# EAGLE design M707A (EAGLE 6.6.0)
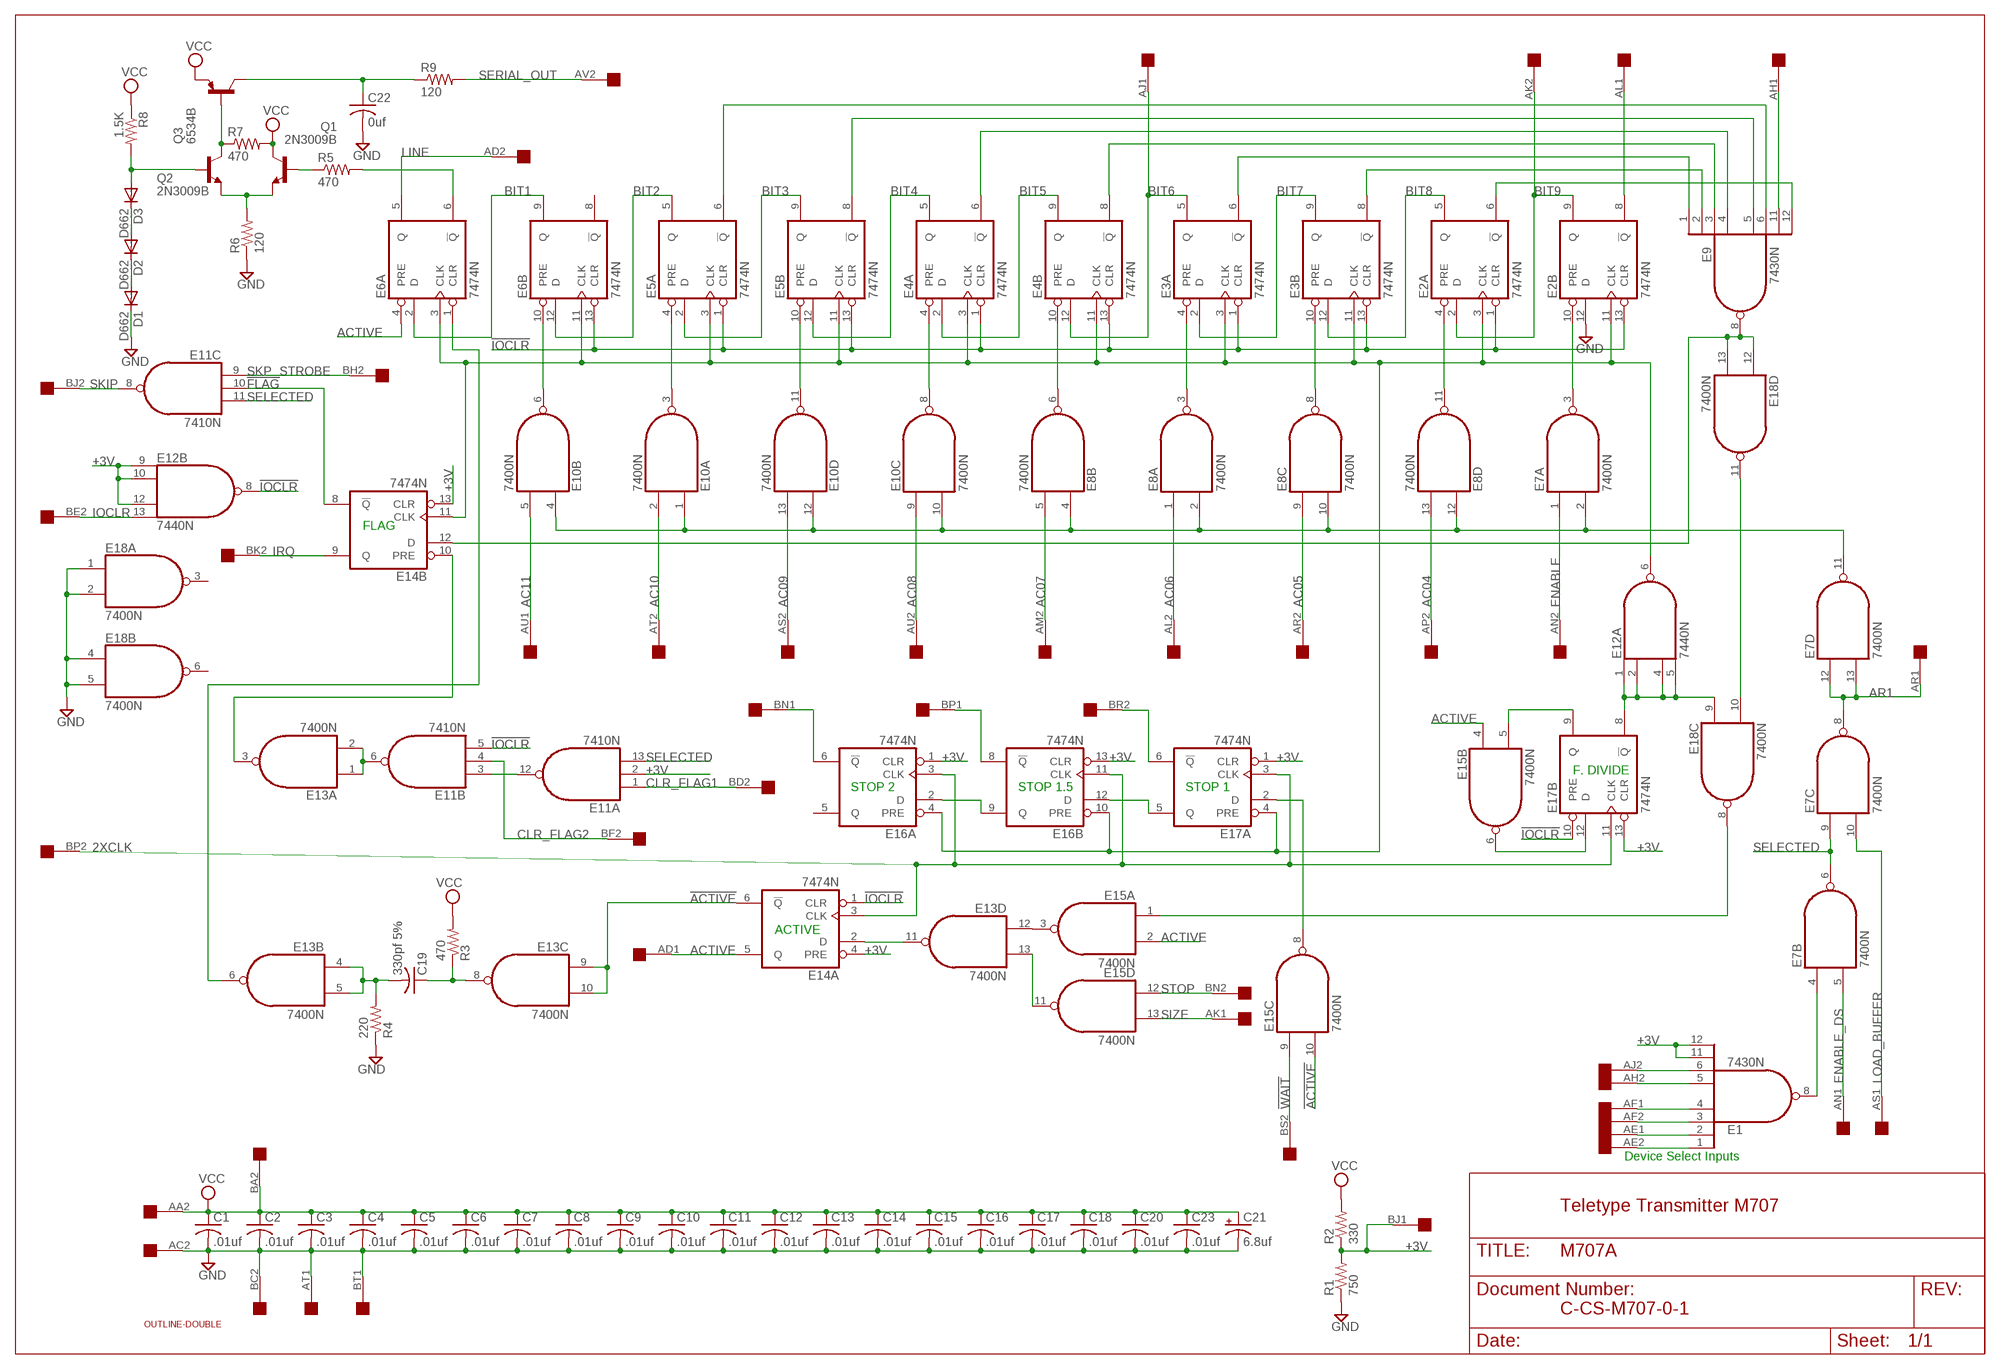
[diagram p0: schematic, sheet 1]

## Parts
C1  .01uf  C-US075-032X103  [C075-032X103]
C2  .01uf  C-US075-032X103  [C075-032X103]
C3  .01uf  C-US075-032X103  [C075-032X103]
C4  .01uf  C-US075-032X103  [C075-032X103]
C5  .01uf  C-US075-032X103  [C075-032X103]
C6  .01uf  C-US075-032X103  [C075-032X103]
C7  .01uf  C-US075-032X103  [C075-032X103]
C8  .01uf  C-US075-032X103  [C075-032X103]
C9  .01uf  C-US075-032X103  [C075-032X103]
C10  .01uf  C-US075-032X103  [C075-032X103]
C11  .01uf  C-US075-032X103  [C075-032X103]
C12  .01uf  C-US075-032X103  [C075-032X103]
C13  .01uf  C-US075-032X103  [C075-032X103]
C14  .01uf  C-US075-032X103  [C075-032X103]
C15  .01uf  C-US075-032X103  [C075-032X103]
C16  .01uf  C-US075-032X103  [C075-032X103]
C17  .01uf  C-US075-032X103  [C075-032X103]
C18  .01uf  C-US075-032X103  [C075-032X103]
C19  330pf 5%  C-US150-054X183  [C150-054X183]
C20  .01uf  C-US075-032X103  [C075-032X103]
C21  6.8uf  CPOL-USE15-5AXIAL  [E15-5]
C22  0uf  C-US075-032X103  [C075-032X103]
C23  .01uf  C-US075-032X103  [C075-032X103]
D1  D662  BY609  [SOD61B]
D2  D662  BY609  [SOD61B]
D3  D662  BY609  [SOD61B]
E1  7430N  [DIL14]
E2  7474N  74S74N  [DIL14]
E3  7474N  74S74N  [DIL14]
E4  7474N  74S74N  [DIL14]
E5  7474N  74S74N  [DIL14]
E6  7474N  74S74N  [DIL14]
E7  7400N  [DIL14]
E8  7400N  [DIL14]
E9  7430N  [DIL14]
E10  7400N  [DIL14]
E11  7410N  [DIL14]
E12  7440N  74S20N  [DIL14]
E13  7400N  [DIL14]
E14  7474N  74S74N  [DIL14]
E15  7400N  [DIL14]
E16  7474N  74S74N  [DIL14]
E17  7474N  74S74N  [DIL14]
E18  7400N  [DIL14]
Q1  2N3009B  2N4124-NPN-TO92-CBE  [TO92-CBE]
Q2  2N3009B  2N4124-NPN-TO92-CBE  [TO92-CBE]
Q3  6534B  2N4126-PNP-TO92-CBE  [TO92-CBE]
R1  750  R-US_0207/15  [0207/15]
R2  330  R-US_0207/15  [0207/15]
R3  470  R-US_0207/10  [0207/10]
R4  220  R-US_0207/10  [0207/10]
R5  470  R-US_0207/10  [0207/10]
R6  120  R-US_0207/15  [0207/15]
R7  470  R-US_0207/10  [0207/10]
R8  1.5K  R-US_0207/15  [0207/15]
R9  120  R-US_0207/10  [0207/10]
U$1  OUTLINE-DOUBLE  [DOUBLE]
U$2  DOUBLE  [EDGE-CON4]

## Nets
2XCLK: E14.3(A:CLK) E16.3(A:CLK) E16.11(B:CLK) E17.3(A:CLK) E17.11(B:CLK) U$2.BP2
!ACTIVE: E13.9(C:I0) E13.10(C:I1) E14.6(A:!Q) E15.10(C:I1)
!FLAG: E11.10(C:I1) E14.8(B:!Q)
!IOCLR: E2.1(A:CLR) E2.13(B:CLR) E3.1(A:CLR) E3.13(B:CLR) E4.1(A:CLR) E4.13(B:CLR) E5.1(A:CLR) E5.13(B:CLR) E6.13(B:CLR) E11.5(B:I2) E12.8(B:O) E14.1(A:CLR) E17.10(B:PRE)
!WAIT: E15.9(C:I0) U$2.BS2
+3V: E1.11(I6) E1.12(I7) E11.2(A:I1) E12.9(B:I0) E12.10(B:I1) E12.12(B:I2) E14.4(A:PRE) E14.13(B:CLR) E16.1(A:CLR) E16.13(B:CLR) E17.1(A:CLR) E17.13(B:CLR) R1.2 R2.1 U$2.BJ1
AC04: E8.13(D:I1) U$2.AP2
AC05: E8.9(C:I0) U$2.AR2
AC06: E8.1(A:I0) U$2.AL2
AC07: E8.5(B:I1) U$2.AM2
AC08: E10.9(C:I0) U$2.AU2
AC09: E10.13(D:I1) U$2.AS2
AC10: E10.2(A:I1) U$2.AT2
AC11: E10.5(B:I1) U$2.AU1
ACTIVE: E6.4(A:PRE) E14.5(A:Q) E15.2(A:I1) E15.4(B:I0) U$2.AD1
AE1: E1.2(I1) U$2.AE1
AF1: E1.4(I3) U$2.AF1
AH1: E9.11(I6) U$2.AH1
AL1: E2.8(B:!Q) U$2.AL1
AR1: E7.8(C:O) E7.12(D:I0) E7.13(D:I1) U$2.AR1
BIT1: E6.2(A:D) E6.9(B:Q)
BIT2: E5.5(A:Q) E6.12(B:D)
BIT3: E5.2(A:D) E5.9(B:Q)
BIT4: E4.5(A:Q) E5.12(B:D)
BIT5: E4.2(A:D) E4.9(B:Q)
BIT6: E3.5(A:Q) E4.12(B:D) U$2.AJ1
BIT7: E3.2(A:D) E3.9(B:Q)
BIT8: E2.5(A:Q) E3.12(B:D)
BIT9: E2.2(A:D) E2.9(B:Q) U$2.AK2
BN1: E16.6(A:!Q) U$2.BN1
BP1: E16.8(B:!Q) U$2.BP1
CLR_FLAG1: E11.1(A:I0) U$2.BD2
CLR_FLAG2: E11.4(B:I1) U$2.BF2
ENABLE: E7.1(A:I0) U$2.AN2
ENABLE_DS: E7.5(B:I1) U$2.AN1
GND [Supply]: C1.2 C2.2 C3.2 C4.2 C5.2 C6.2 C7.2 C8.2 C9.2 C10.2 C11.2 C12.2 C13.2 C14.2 C15.2 C16.2 C17.2 C18.2 C20.2 C21.- C22.2 C23.2 D1.C E2.12(B:D) E18.1(A:I0) E18.2(A:I1) E18.4(B:I0) E18.5(B:I1) R1.1 R4.1 R6.1 U$2.AC2 U$2.AT1 U$2.BC2 U$2.BT1
IOCLR: E12.13(B:I3) U$2.BE2
IRQ: E14.9(B:Q) U$2.BK2
LINE: E6.5(A:Q) U$2.AD2
LOAD_BUFFER: E7.10(C:I1) U$2.AS1
N$1: C19.1 E13.8(C:O) R3.1
N$2: C19.2 E13.4(B:I0) E13.5(B:I1) R4.2
N$3: E2.4(A:PRE) E8.11(D:O)
N$4: E6.1(A:CLR) E13.6(B:O)
N$5: E2.3(A:CLK) E2.11(B:CLK) E3.3(A:CLK) E3.11(B:CLK) E4.3(A:CLK) E4.11(B:CLK) E5.3(A:CLK) E5.11(B:CLK) E6.3(A:CLK) E6.11(B:CLK) E12.6(A:O) E14.11(B:CLK) E16.4(A:PRE) E16.10(B:PRE) E17.4(A:PRE)
N$6: E9.8(O) E14.12(B:D) E18.12(D:I0) E18.13(D:I1)
N$7: E2.6(A:!Q) E9.12(I7)
N$8: C22.1 Q3.C R9.1
N$9: E1.8(O) E7.4(B:I0)
N$12: E1.6(I5) U$2.AJ2
N$13: E1.5(I4) U$2.AH2
N$15: E1.3(I2) U$2.AF2
N$17: E1.1(I0) U$2.AE2
N$19: E7.2(A:I1) E7.11(D:O) E8.2(A:I1) E8.4(B:I0) E8.10(C:I1) E8.12(D:I0) E10.1(A:I0) E10.4(B:I0) E10.10(C:I1) E10.12(D:I0)
N$20: E2.10(B:PRE) E7.3(A:O)
N$22: D1.A D2.C
N$23: D2.A D3.C
N$24: Q1.B R5.1
N$26: Q2.C Q3.B R7.1
N$27: Q1.E Q2.E R6.2
N$30: D3.A Q2.B R8.2
N$40: E6.6(A:!Q) R5.2
N$62: E13.13(D:I1) E15.11(D:O)
N$63: E17.6(A:!Q) U$2.BR2
N$65: E3.4(A:PRE) E8.3(A:O)
N$129: E15.1(A:I0) E18.8(C:O)
N$131: E13.12(D:I0) E15.3(A:O)
N$132: E11.3(B:I0) E11.12(A:O)
N$133: E12.1(A:I0) E12.2(A:I1) E12.4(A:I2) E12.5(A:I3) E17.8(B:!Q) E18.9(C:I0)
N$138: E16.2(A:D) E16.9(B:Q)
N$142: E3.6(A:!Q) E9.1(I0)
N$147: E4.4(A:PRE) E10.8(C:O)
N$152: E3.8(B:!Q) E9.2(I1)
N$153: E4.8(B:!Q) E9.3(I2)
N$154: E4.6(A:!Q) E9.4(I3)
N$155: E5.8(B:!Q) E9.5(I4)
N$156: E5.6(A:!Q) E9.6(I5)
N$161: E15.8(C:O) E17.2(A:D)
N$163: E11.6(B:O) E13.1(A:I0) E13.2(A:I1)
N$166: E16.12(B:D) E17.5(A:Q)
N$167: E13.3(A:O) E14.10(B:PRE)
N$171: E5.4(A:PRE) E10.3(A:O)
N$178: E13.11(D:O) E14.2(A:D)
N$358: E15.6(B:O) E17.12(B:D)
N$362: E15.5(B:I1) E17.9(B:Q)
N$378: E3.10(B:PRE) E8.8(C:O)
N$381: E4.10(B:PRE) E8.6(B:O)
N$387: E5.10(B:PRE) E10.11(D:O)
N$393: E6.10(B:PRE) E10.6(B:O)
N$460: E18.10(C:I1) E18.11(D:O)
SELECTED: E7.6(B:O) E7.9(C:I0) E11.11(C:I2) E11.13(A:I2)
SERIAL_OUT: R9.2 U$2.AV2
SIZE: E15.13(D:I1) U$2.AK1
SKIP: E11.8(C:O) U$2.BJ2
SKP_STROBE: E11.9(C:I0) U$2.BH2
STOP: E15.12(D:I0) U$2.BN2
VCC [Supply]: C1.1 C2.1 C3.1 C4.1 C5.1 C6.1 C7.1 C8.1 C9.1 C10.1 C11.1 C12.1 C13.1 C14.1 C15.1 C16.1 C17.1 C18.1 C20.1 C21.+ C23.1 Q1.C Q3.E R2.2 R3.2 R7.2 R8.1 U$2.AA2 U$2.BA2
Unconnected: E6.8(B:!Q) E16.5(A:Q) E18.3(A:O) E18.6(B:O) U$2.AA1 U$2.AB1 U$2.AB2 U$2.AC1 U$2.AM1 U$2.AP1 U$2.AV1 U$2.BA1 U$2.BB1 U$2.BB2 U$2.BC1 U$2.BD1 U$2.BE1 U$2.BF1 U$2.BH1 U$2.BK1 U$2.BL1 U$2.BL2 U$2.BM1 U$2.BM2 U$2.BR1 U$2.BS1 U$2.BT2 U$2.BU1 U$2.BU2 U$2.BV1 U$2.BV2

## Notes on the sheet
- FLAG
- F. DIVIDE
- STOP 2 | STOP 1.5 | STOP 1
- ACTIVE
- Device Select Inputs
- Teletype Transmitter M707
- C-CS-M707-0-1

## Power pins joined to a net without a drawn wire
GND: E1.7(GND) E2.7(P:GND) E3.7(P:GND) E4.7(P:GND) E5.7(P:GND) E6.7(P:GND) E7.7(P:GND) E8.7(P:GND) E9.7(GND) E10.7(P:GND) E11.7(P:GND) E12.7(P:GND) E13.7(P:GND) E14.7(P:GND) E15.7(P:GND) E16.7(P:GND) E17.7(P:GND) E18.7(P:GND)
VCC: E1.14(VCC) E2.14(P:VCC) E3.14(P:VCC) E4.14(P:VCC) E5.14(P:VCC) E6.14(P:VCC) E7.14(P:VCC) E8.14(P:VCC) E9.14(VCC) E10.14(P:VCC) E11.14(P:VCC) E12.14(P:VCC) E13.14(P:VCC) E14.14(P:VCC) E15.14(P:VCC) E16.14(P:VCC) E17.14(P:VCC) E18.14(P:VCC)

## Library data of the parts
C1-C20 C22 C23 = rcl:C-US: CAPACITOR, American symbol
C21 = rcl:CPOL-US: POLARIZED CAPACITOR, American symbol
D1-D3 = diode:BY609: DIODE
E1 E9 = 74xx-us:74*30: 8-input NAND gate
E2-E6 E14 E16 E17 = 74xx-us:74*74: Dual D type positive edge triggered FLIP FLOP, preset and clear
E7 E8 E10 E13 E15 E18 = 74xx-us:74*00: Quad 2-input NAND gate
E11 = 74xx-us:74*10: Triple 3-input NAND gate
E12 = 74xx-us:74*20: Dual 4-input NAND gate
Q1 Q2 = transistor:*-NPN-: NPN Transistror BF959 corrected 2008.03.06
Q3 = transistor:*-PNP-: PNP Transistror
R1-R9 = rcl:R-US_: RESISTOR, American symbol
U$1 = dec-con:OUTLINE-*: Board outlines for DEC boards.
U$2 = dec-con:DOUBLE: Double-Height DEC board

## Net classes
1 Supply: width 0.813 mm

## Board
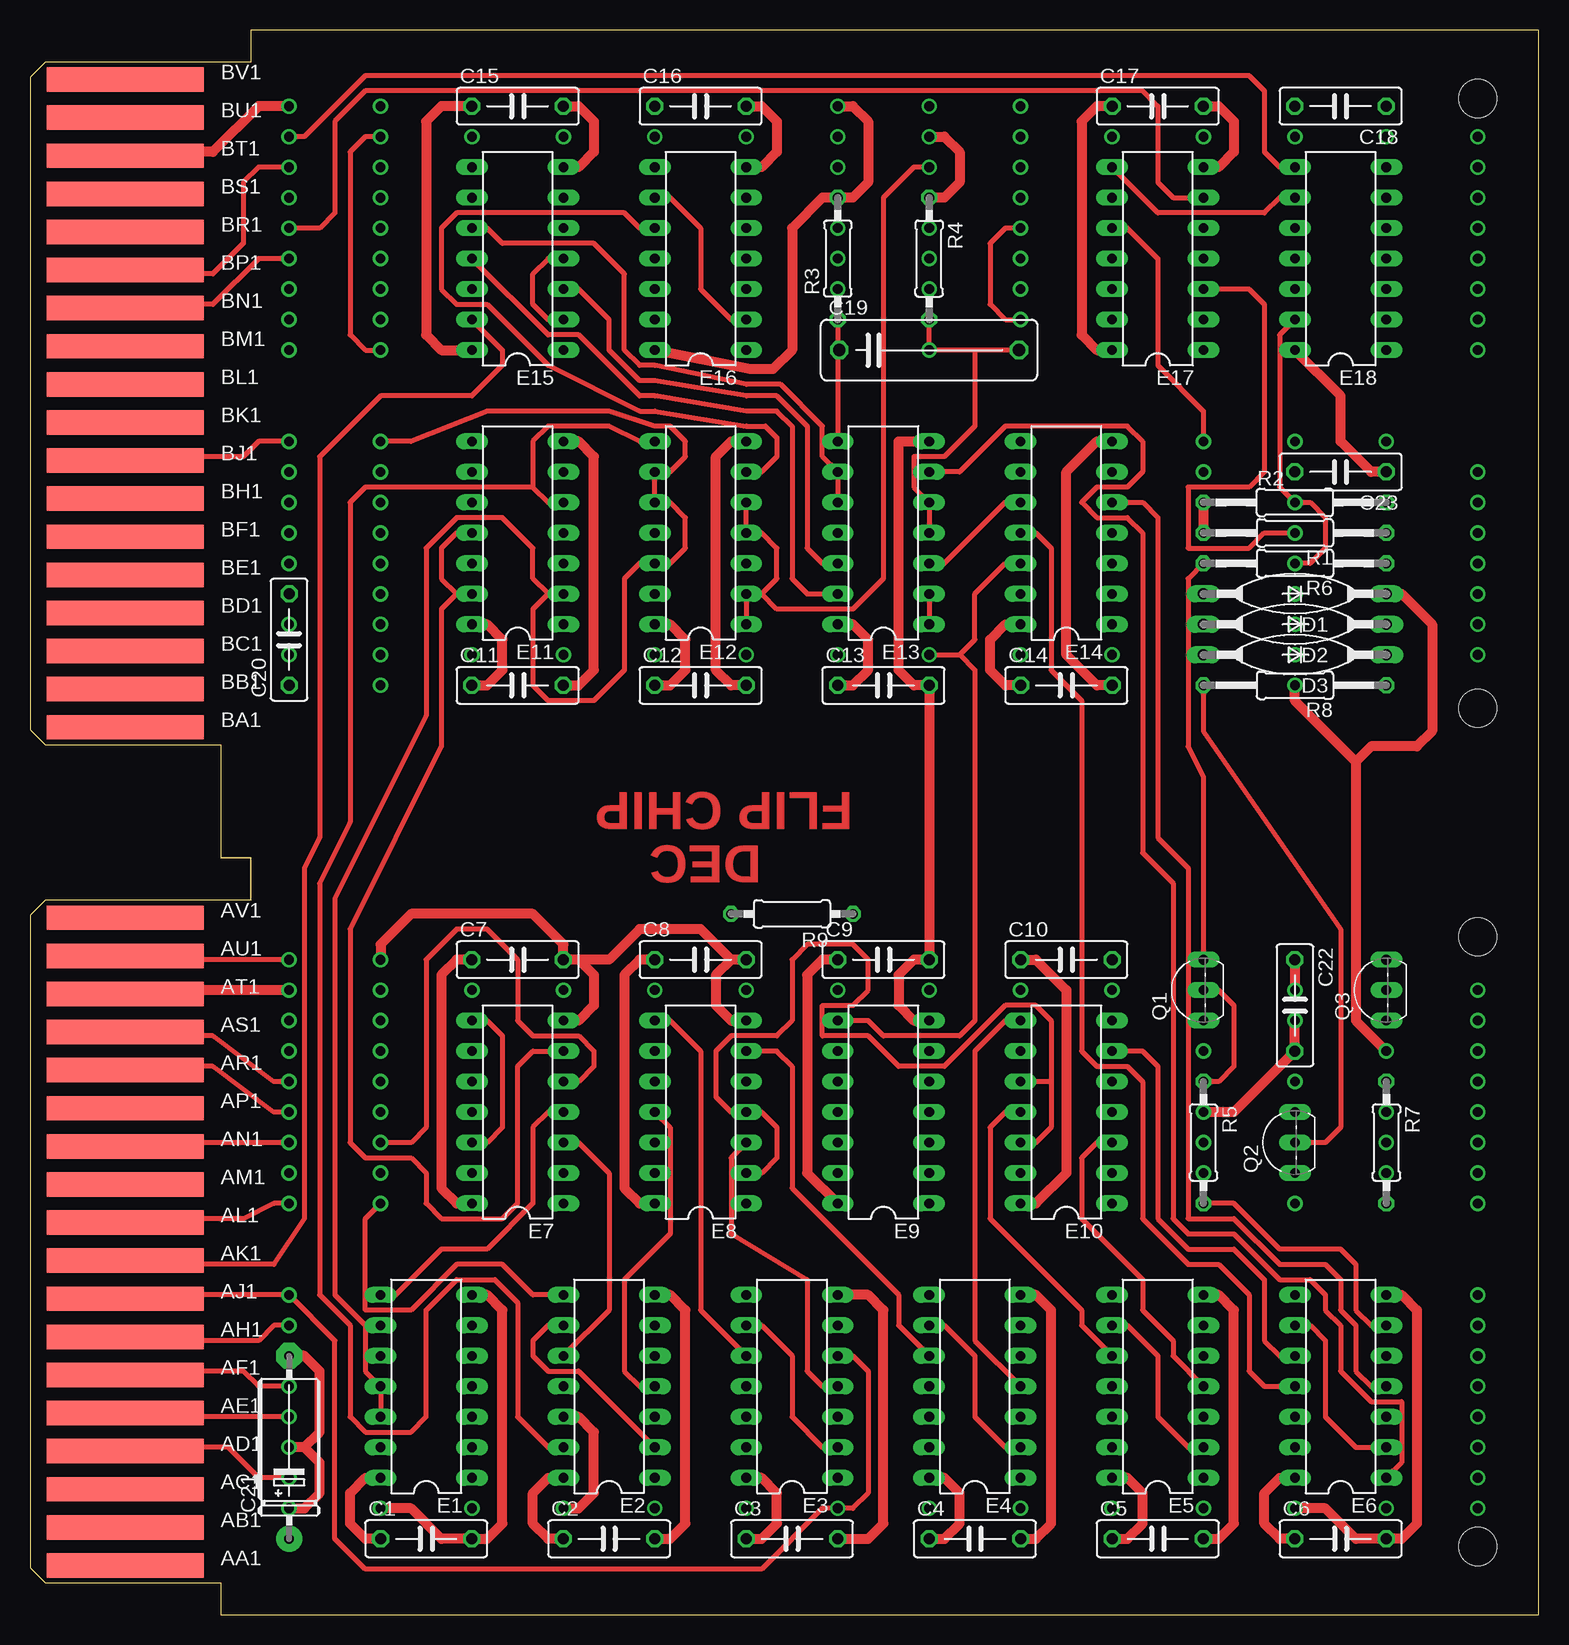
[diagram p1: board, top side]
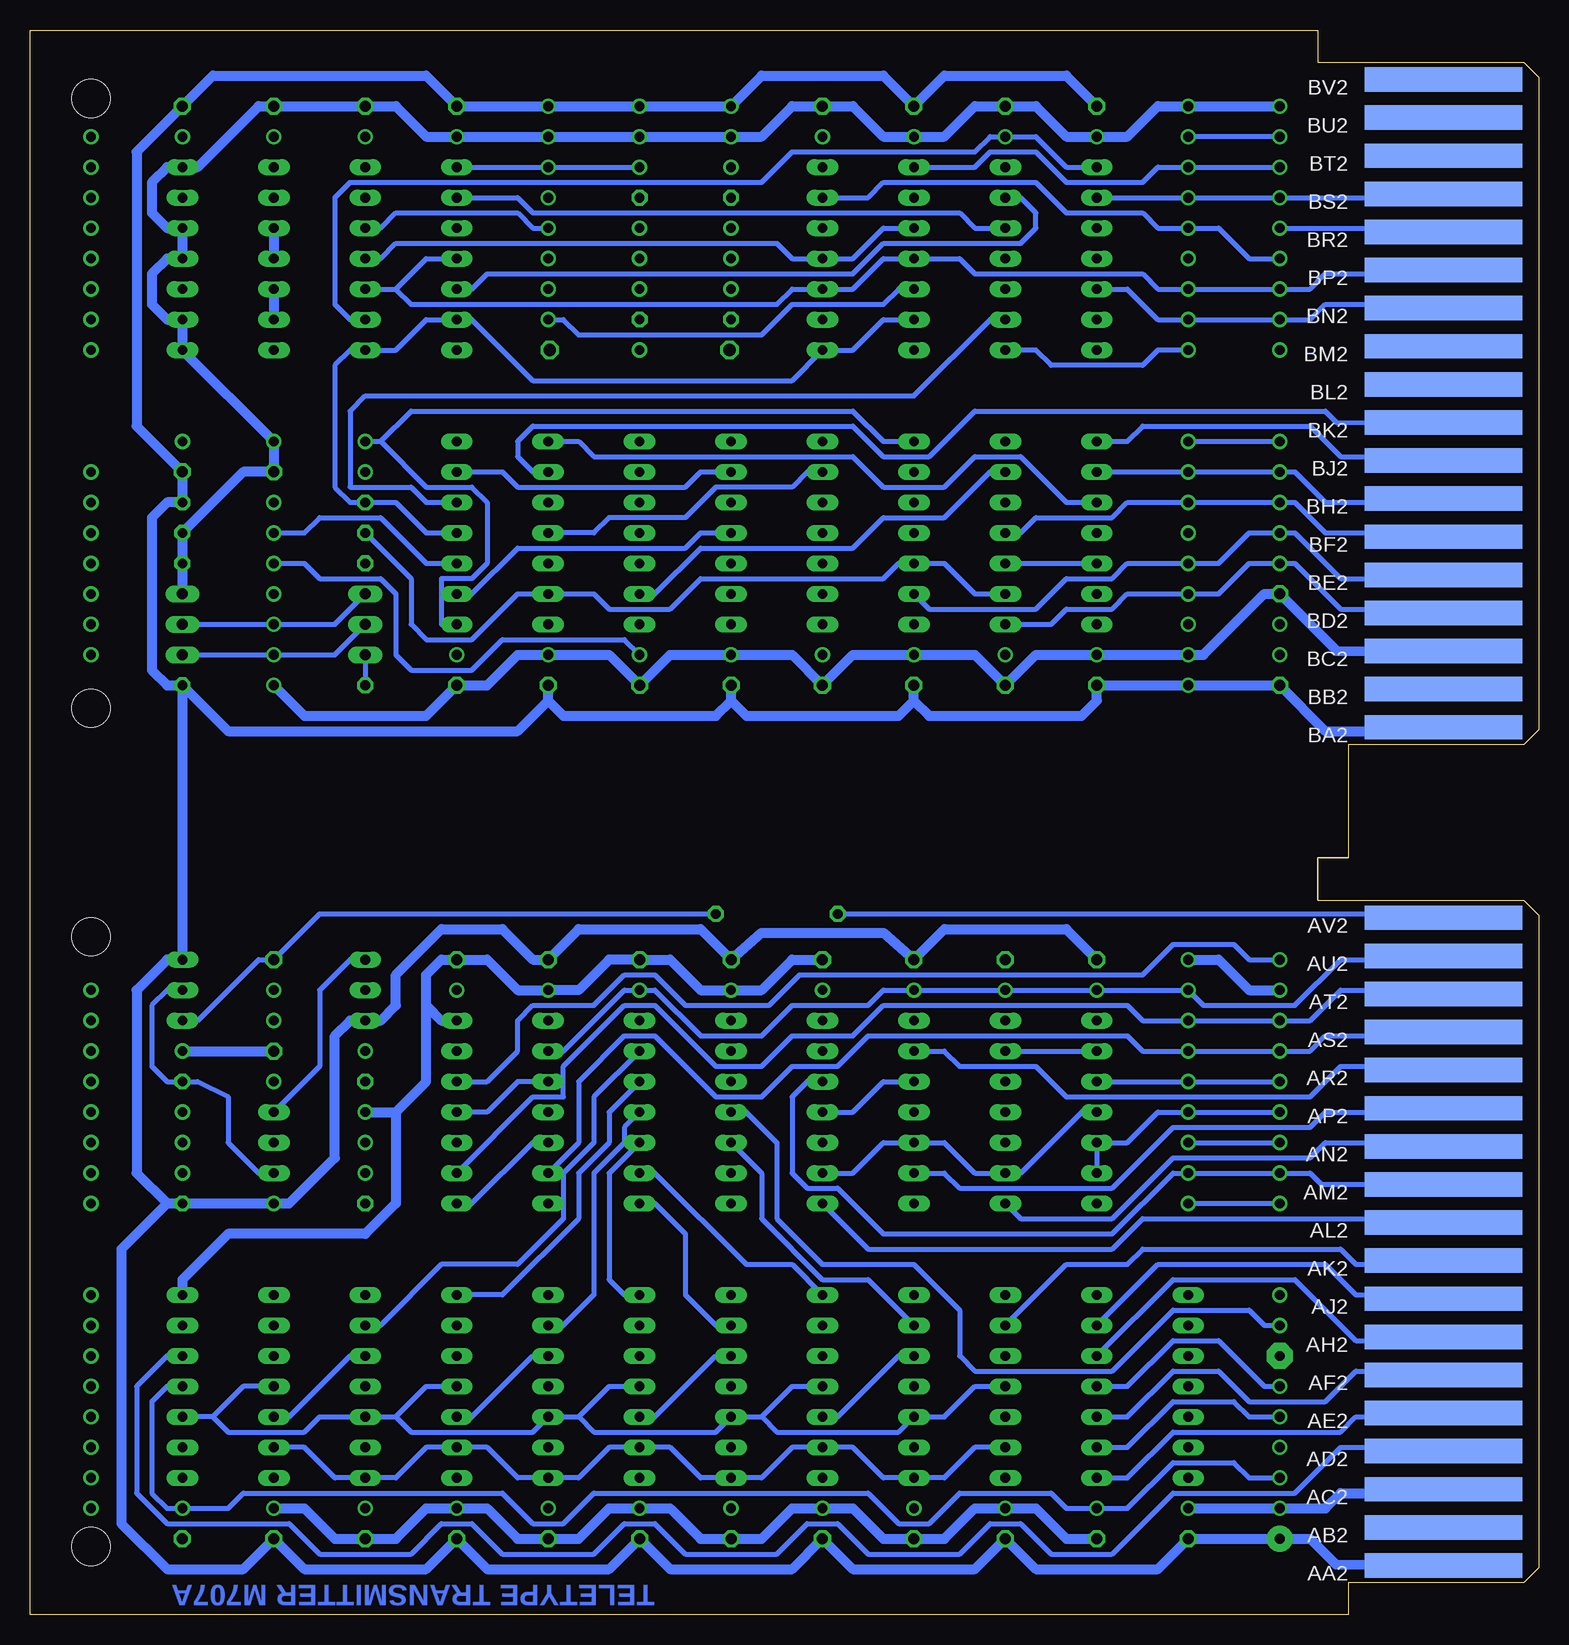
[diagram p2: board, bottom side, seen from below]

Size 125.73 x 132.08 mm. Coordinates in mm from the lower left corner, seen from the top.
Copper layers (1+16): Top 0.035mm / dielectric 1.5mm / Bottom 0.035mm
Design rules "16mils": minimum track width 16mil, minimum drill 32mil, track to track 15mil, track to pad 10mil, pad to pad 10mil, via to via 10mil, smd to smd 10mil, copper to edge 13mil, drill to drill 10mil, minimum pad ring 10mil, minimum via ring 8mil, stop-mask expansion 0mil, vias tented up to drill 0mil, thermal gap 10mil

### Footprints (pad centres in the part's own frame; a part is rotated, then mirrored left to right if it is on the bottom)
C075-032X103 = drill 0.914 octagon: 1 -3.81,0; 2 3.81,0
C150-054X183 = drill 1.016 octagon: 1 -7.493,0; 2 7.493,0
E15-5 = drill 0.813 pad 2.159: + -7.62,0 | drill 0.813 pad 2.159 octagon: - 7.62,0
SOD61B = drill 0.914 long: A 7.62,0; C -7.62,0
DIL14 = drill 0.813 long: 1 -7.62,-3.81; 2 -5.08,-3.81; 3 -2.54,-3.81; 4 0,-3.81; 5 2.54,-3.81; 6 5.08,-3.81; 7 7.62,-3.81; 8 7.62,3.81; 9 5.08,3.81; 10 2.54,3.81; 11 0,3.81; 12 -2.54,3.81; 13 -5.08,3.81; 14 -7.62,3.81
TO92-CBE = drill 0.813 long: B 0,0; C -2.54,0; E 2.54,0
0207/15 = drill 0.813 octagon: 1 -7.62,0; 2 7.62,0
0207/10 = drill 0.813 octagon: 1 -5.08,0; 2 5.08,0
DOUBLE = hole 3.175: 120.65,56.515; 120.65,5.715; 120.65,75.565; 120.65,126.365
EDGE-CON4 = smd 13.106 x 2.032: AA1 7.938,4.128; AB1 7.938,7.303; AC1 7.938,10.477; AD1 7.938,13.652; AE1 7.938,16.828; AF1 7.938,20.003; AH1 7.938,23.177; AJ1 7.938,26.352; AK1 7.938,29.527; AL1 7.938,32.703; AM1 7.938,35.877; AN1 7.938,39.053; AP1 7.938,42.227; AR1 7.938,45.403; AS1 7.938,48.578; AT1 7.938,51.752; AU1 7.938,54.928; AV1 7.938,58.102; BA1 7.938,73.978; BB1 7.938,77.153; BC1 7.938,80.328; BD1 7.938,83.502; BE1 7.938,86.677; BF1 7.938,89.853; BH1 7.938,93.028; BJ1 7.938,96.203; BK1 7.938,99.377; BL1 7.938,102.552; BM1 7.938,105.728; BN1 7.938,108.903; BP1 7.938,112.078; BR1 7.938,115.252; BS1 7.938,118.427; BT1 7.938,121.603; BU1 7.938,124.778; BV1 7.938,127.953 | smd 13.106 x 2.032 bottom: AA2 7.938,4.128; AB2 7.938,7.303; AC2 7.938,10.477; AD2 7.938,13.652; AE2 7.938,16.828; AF2 7.938,20.003; AH2 7.938,23.177; AJ2 7.938,26.352; AK2 7.938,29.527; AL2 7.938,32.703; AM2 7.938,35.877; AN2 7.938,39.053; AP2 7.938,42.227; AR2 7.938,45.403; AS2 7.938,48.578; AT2 7.938,51.752; AU2 7.938,54.928; AV2 7.938,58.102; BA2 7.938,73.978; BB2 7.938,77.153; BC2 7.938,80.328; BD2 7.938,83.502; BE2 7.938,86.677; BF2 7.938,89.853; BH2 7.938,93.028; BJ2 7.938,96.203; BK2 7.938,99.377; BL2 7.938,102.552; BM2 7.938,105.728; BN2 7.938,108.903; BP2 7.938,112.078; BR2 7.938,115.252; BS2 7.938,118.427; BT2 7.938,121.603; BU2 7.938,124.778; BV2 7.938,127.953

### Placement (x,y rotation side)
C1  33.02,6.35 0 top
C2  48.26,6.35 0 top
C3  63.5,6.35 0 top
C4  78.74,6.35 0 top
C5  93.98,6.35 0 top
C6  109.22,6.35 0 top
C7  40.64,54.61 0 top
C8  55.88,54.61 0 top
C9  71.12,54.61 0 top
C10  86.36,54.61 0 top
C11  40.64,77.47 0 top
C12  55.88,77.47 0 top
C13  71.12,77.47 0 top
C14  86.36,77.47 0 top
C15  40.64,125.73 0 top
C16  55.88,125.73 0 top
C17  93.98,125.73 0 top
C18  109.22,125.73 180 top
C19  74.93,105.41 0 top
C20  21.59,81.28 90 top
C21  21.59,13.97 90 top
C22  105.41,50.8 270 top
C23  109.22,95.25 180 top
D1  105.41,85.09 180 top
D2  105.41,82.55 180 top
D3  105.41,80.01 180 top
E1  33.02,19.05 90 top
E2  48.26,19.05 90 top
E3  63.5,19.05 90 top
E4  78.74,19.05 90 top
E5  93.98,19.05 90 top
E6  109.22,19.05 90 top
E7  40.64,41.91 90 top
E8  55.88,41.91 90 top
E9  71.12,41.91 90 top
E10  86.36,41.91 90 top
E11  40.64,90.17 90 top
E12  55.88,90.17 90 top
E13  71.12,90.17 90 top
E14  86.36,90.17 90 top
E15  40.64,113.03 90 top
E16  55.88,113.03 90 top
E17  93.98,113.03 90 top
E18  109.22,113.03 90 top
Q1  97.79,52.07 90 top
Q2  105.41,39.37 90 top
Q3  113.03,52.07 90 top
R1  105.41,90.17 180 top
R2  105.41,92.71 0 top
R3  67.31,113.03 90 top
R4  74.93,113.03 270 top
R5  97.79,39.37 270 top
R6  105.41,87.63 180 top
R7  113.03,39.37 270 top
R8  105.41,77.47 180 top
R9  63.5,58.42 180 top
U$1  0,0 0 top
U$2  0,0 0 top

### Tracks (layer width: path | path; a pad name or v marks a point on that pad's centre or on a via)
2XCLK  (via drill 0.81 pad 1.27)
  Top 0.406: E17.3 101.6,110.49 102.87,109.22 102.87,95.25 101.6,93.98 96.52,93.98 96.52,88.9 101.6,88.9 102.87,90.17 v105.41,90.17
  Bottom 0.406: E17.3 95.25,110.49 | 95.25,110.49 92.71,113.03 E17.11 | 95.25,110.49 93.98,109.22 63.5,109.22 62.23,110.49 E16.3 57.15,110.49 54.61,113.03 E16.11 48.26,113.03 46.99,111.76 33.02,111.76 31.75,110.49 v29.21,110.49 v21.59,110.49 19.05,110.49 17.78,111.76 13.97,111.76 13.64,112.09 U$2.BP2 | v105.41,90.17 102.87,90.17 101.6,91.44 96.52,91.44 92.71,87.63 E14.3
!ACTIVE
  Top 0.406: E15.10 38.1,115.57 39.37,114.3 46.99,114.3 49.53,111.76 49.53,105.41 50.8,104.14 52.07,104.14 59.69,102.55 62.55,102.55 66.04,99.06 66.04,96.52 E13.9 E13.10
  Bottom 0.406: E14.6 86.36,95.25 85.09,93.98 71.12,93.98 69.85,95.25 E13.9
!FLAG
  Bottom 0.406: E11.10 39.37,92.71 43.18,96.52 46.99,96.52 49.53,93.98 54.61,93.98 57.15,96.52 78.74,96.52 80.01,97.79 E14.8
!IOCLR  (via drill 0.81 pad 1.27)
  Top 0.406: E2.13 43.18,13.97 40.64,16.51 40.64,26.04 38.74,27.94 35.56,27.94 33.02,25.4 33.02,16.51 31.75,15.24 27.94,15.24 26.67,16.51 26.67,24.13 24.13,26.67 24.13,60.96 26.67,66.04 26.67,92.71 27.94,93.98 41.91,93.98 | E12.8 50.8,97.79 48.26,99.06 43.18,99.06 41.91,97.79 41.91,93.98 | 41.91,93.98 43.18,92.71 E11.5 | v97.79,97.79 97.79,100.33 93.98,104.14 93.98,113.03 91.44,115.57 E17.10
  Bottom 0.406: E6.13 102.87,13.97 100.33,11.43 E5.1 95.25,11.43 92.71,13.97 E5.13 87.63,13.97 85.09,11.43 E4.1 80.01,11.43 77.47,13.97 E4.13 72.39,13.97 69.85,11.43 E3.1 64.77,11.43 62.23,13.97 E3.13 57.15,13.97 54.61,11.43 E2.1 49.53,11.43 46.99,13.97 E2.13 | v97.79,97.79 96.52,97.79 | 96.52,97.79 92.71,93.98 88.9,93.98 87.63,92.71 87.63,87.63 88.9,86.36 91.44,86.36 91.44,82.55 E14.1 | 96.52,97.79 93.98,100.33 57.15,100.33 54.61,97.79 E12.8
!WAIT  (via drill 0.81 pad 1.27)
  Bottom 0.406: E15.9 v29.21,118.11 v21.59,118.11 13.97,118.11 13.67,118.42 U$2.BS2
+3V  (via drill 0.81 pad 1.27)
  Top 0.406: v21.59,97.79 19.05,97.79 17.78,96.52 11.43,96.52 11.1,96.19 U$2.BJ1 | E1.12 E1.11 27.94,20.32 27.94,24.13 25.4,26.67 25.4,59.69 33.02,74.93 33.02,88.9 35.56,91.44 39.37,91.44 41.91,88.9 41.91,86.36 43.18,85.09 | v29.21,97.79 31.75,97.79 38.1,100.33 48.26,100.33 52.07,99.06 53.34,99.06 54.61,97.79 54.61,96.52 53.34,95.25 E12.9 E12.10 53.34,92.71 54.61,91.44 54.61,88.9 53.34,87.63 E12.12 50.8,87.63 49.53,86.36 49.53,78.74 46.99,76.2 43.18,76.2 41.91,77.47 41.91,83.82 43.18,85.09 | E11.2 43.18,85.09
  Top 0.813: R2.1 R1.2
  Bottom 0.406: v29.21,97.79 v21.59,97.79 | E16.13 54.61,107.95 57.15,105.41 E16.1 62.23,102.87 83.82,102.87 88.9,107.95 E17.13 92.71,107.95 95.25,105.41 E17.1 99.06,105.41 100.33,104.14 100.33,93.98 99.06,92.71 R2.1 95.25,92.71 92.71,90.17 E14.4 | E11.2 46.99,85.09 49.53,87.63 E12.12 53.34,87.63 54.61,86.36 69.85,86.36 72.39,83.82 77.47,83.82 78.74,85.09 E14.13 85.09,85.09 88.9,81.28 92.71,81.28 93.98,82.55 93.98,86.36 R1.2
AC04
  Bottom 0.406: U$2.AP2 13.64,42.24 13.97,41.91 17.78,41.91 19.05,40.64 30.48,40.64 35.56,35.56 48.26,35.56 49.53,36.83 E8.13
AC05
  Bottom 0.406: E8.9 49.53,46.99 48.26,45.72 41.91,45.72 39.37,43.18 19.05,43.18 16.51,45.72 13.97,45.72 13.64,45.39 U$2.AR2
AC06
  Bottom 0.406: U$2.AL2 13.64,32.69 13.97,33.02 33.02,33.02 35.56,30.48 55.88,30.48 E8.1
AC07  (via drill 0.81 pad 1.27)
  Bottom 0.406: U$2.AM2 18.11,35.89 19.05,36.83 v21.59,36.83 v29.21,36.83 30.48,36.83 35.56,31.75 54.61,31.75 58.42,35.56 60.96,35.56 62.23,36.83 62.23,43.18 60.96,44.45 E8.5
AC08  (via drill 0.81 pad 1.27)
  Bottom 0.406: U$2.AU2 13.61,54.97 13.97,54.61 16.51,54.61 20.32,50.8 27.94,50.8 v29.21,52.07 v36.83,52.07 v44.45,52.07 v52.07,52.07 54.61,52.07 55.88,50.8 62.23,50.8 64.77,48.26 69.85,48.26 73.66,52.07 v74.93,52.07 76.2,52.07 81.28,46.99 E10.9
AC09  (via drill 0.81 pad 1.27)
  Bottom 0.406: U$2.AS2 13.67,48.56 13.97,48.26 17.78,48.26 19.05,46.99 v21.59,46.99 v29.21,46.99 33.02,46.99 34.29,48.26 55.88,48.26 58.42,45.72 62.23,45.72 64.77,43.18 68.58,43.18 73.66,48.26 76.2,48.26 80.01,44.45 80.01,39.37 E10.13
AC10  (via drill 0.81 pad 1.27)
  Bottom 0.406: U$2.AT2 13.64,51.74 13.97,52.07 16.51,52.07 19.05,49.53 v21.59,49.53 v29.21,49.53 33.02,49.53 34.29,50.8 54.61,50.8 57.15,48.26 62.23,48.26 64.77,45.72 68.58,45.72 73.66,50.8 76.2,50.8 81.28,45.72 81.28,43.18 83.82,43.18 E10.2
AC11  (via drill 0.81 pad 1.27)
  Top 0.406: v21.59,54.61 11.43,54.61 11.1,54.94 U$2.AU1
  Bottom 0.406: E10.5 87.63,44.45 85.09,46.99 85.09,49.53 83.82,50.8 78.74,50.8 76.2,53.34 73.66,53.34 71.12,50.8 64.14,50.8 61.6,53.34 33.02,53.34 30.48,55.88 25.4,55.88 24.13,54.61 v21.59,54.61
ACTIVE  (via drill 0.81 pad 1.27)
  Top 0.406: v21.59,11.43 19.05,11.43 16.51,13.97 7.62,13.97 U$2.AD1 | E14.5 92.71,92.71 93.98,91.44 93.98,64.77 96.52,62.23 96.52,33.02 100.33,33.02 104.14,29.21 107.95,29.21 109.22,27.94 109.22,25.4 110.49,24.13 110.49,20.32 111.76,19.05 E6.4 | E15.4 43.18,113.03 41.91,111.76 41.91,109.22 43.18,107.95 E15.2
  Bottom 0.406: v21.59,11.43 24.13,11.43 25.4,12.7 30.48,12.7 34.29,8.89 v36.83,8.89 39.37,8.89 40.64,10.16 48.26,10.16 50.8,7.62 53.34,7.62 55.88,10.16 78.74,10.16 81.28,7.62 83.82,7.62 86.36,10.16 107.95,10.16 109.22,8.89 v113.03,8.89 114.3,8.89 115.57,10.16 115.57,17.78 114.3,19.05 E6.4 | E15.2 45.72,107.95 52.07,101.6 97.79,101.6 99.06,100.33 99.06,93.98 93.98,93.98 92.71,92.71 E14.5
AE1  (via drill 0.81 pad 1.27)
  Top 0.406: v21.59,16.51 8.89,16.51 8.56,16.84 U$2.AE1
  Bottom 0.406: v21.59,16.51 24.13,16.51 25.4,17.78 30.48,17.78 34.29,13.97 E1.2
AF1  (via drill 0.81 pad 1.27)
  Top 0.406: v21.59,19.05 19.05,19.05 17.78,20.32 7.62,20.32 U$2.AF1
  Bottom 0.406: E1.4 34.29,19.05 30.48,22.86 26.67,22.86 22.86,19.05 v21.59,19.05
AH1  (via drill 0.81 pad 1.27)
  Top 0.406: v21.59,24.13 20.32,24.13 19.05,22.86 8.89,22.86 8.56,23.19 U$2.AH1
  Bottom 0.406: v21.59,24.13 22.86,24.13 24.13,25.4 30.48,25.4 35.56,20.32 46.99,20.32 48.26,21.59 48.26,25.4 52.07,29.21 59.69,29.21 63.5,33.02 63.5,39.37 66.04,41.91 E9.11
AL1  (via drill 0.81 pad 1.27)
  Top 0.406: E2.8 41.91,26.67 39.37,29.21 35.56,29.21 31.75,25.4 27.94,25.4 27.94,33.02 v29.21,34.29 | v21.59,34.29 20.32,34.29 17.78,33.02 11.43,33.02 11.1,32.69 U$2.AL1
  Bottom 0.406: v29.21,34.29 v21.59,34.29
AR1  (via drill 0.81 pad 1.27)
  Top 0.406: v21.59,41.91 20.32,41.91 15.24,45.72 8.89,45.72 8.56,45.39 U$2.AR1 | E7.8 38.1,49.53 39.37,48.26 39.37,40.64 38.1,39.37 E7.12
  Bottom 0.406: v21.59,41.91 v29.21,41.91 31.75,41.91 34.29,39.37 E7.12 E7.13
BIT1
  Top 0.406: E6.2 110.49,13.97 107.95,16.51 107.95,22.86 106.68,24.13 E6.9
BIT2
  Bottom 0.406: E6.12 104.14,16.51 99.06,21.59 E5.5
BIT3
  Top 0.406: E5.2 96.52,13.97 93.98,16.51 93.98,21.59 91.44,24.13 E5.9
BIT4
  Bottom 0.406: E5.12 88.9,16.51 83.82,21.59 E4.5
BIT5
  Top 0.406: E4.2 81.28,13.97 78.74,16.51 78.74,21.59 76.2,24.13 E4.9
BIT6  (via drill 0.81 pad 1.27)
  Top 0.406: U$2.AJ1 11.1,26.34 11.43,26.67 v21.59,26.67 25.4,22.86 25.4,6.35 27.94,3.81 60.96,3.81 66.04,8.89 v67.31,8.89 68.58,8.89 69.85,10.16 69.85,20.32 68.58,21.59 E3.5
  Bottom 0.406: E4.12 73.66,16.51 68.58,21.59 E3.5
BIT7
  Top 0.406: E3.2 66.04,13.97 63.5,16.51 63.5,21.59 60.96,24.13 E3.9
BIT8
  Bottom 0.406: E3.12 58.42,16.51 53.34,21.59 E2.5
BIT9
  Top 0.406: E2.9 43.18,24.13 41.91,22.86 41.91,21.59 43.18,20.32 45.72,20.32 E2.2
  Bottom 0.406: U$2.AK2 13.67,29.52 13.97,29.21 15.24,29.21 16.51,30.48 33.02,30.48 34.29,29.21 39.37,29.21 E2.9
BN1  (via drill 0.81 pad 1.27)
  Top 0.406: v21.59,113.03 19.05,113.03 15.24,109.22 11.43,109.22 11.1,108.89 U$2.BN1
  Bottom 0.406: v21.59,113.03 24.13,113.03 26.67,115.57 v29.21,115.57 31.75,115.57 33.02,116.84 39.37,116.84 41.91,119.38 54.61,119.38 55.88,118.11 E16.6
BP1  (via drill 0.81 pad 1.27)
  Top 0.406: v21.59,120.65 19.05,120.65 17.78,119.38 17.78,114.3 15.24,111.76 8.89,111.76 8.56,112.09 U$2.BP1
  Bottom 0.406: v21.59,120.65 v29.21,120.65 31.75,120.65 33.02,119.38 39.37,119.38 41.91,121.92 45.72,121.92 46.99,120.65 E16.8
CLR_FLAG1  (via drill 0.81 pad 1.27)
  Bottom 0.406: U$2.BD2 13.67,83.52 13.97,83.82 16.51,83.82 20.32,87.63 v21.59,87.63 24.13,87.63 26.67,85.09 v29.21,85.09 34.29,85.09 35.56,83.82 39.37,83.82 40.64,82.55 E11.1
CLR_FLAG2  (via drill 0.81 pad 1.27)
  Bottom 0.406: U$2.BF2 13.69,89.89 13.97,90.17 17.78,90.17 20.32,92.71 v21.59,92.71 v29.21,92.71 34.29,92.71 35.56,91.44 41.91,91.44 43.18,90.17 E11.4
ENABLE
  Bottom 0.406: U$2.AN2 13.64,39.04 13.97,39.37 17.78,39.37 19.05,38.1 30.48,38.1 35.56,33.02 43.18,33.02 E7.1
ENABLE_DS  (via drill 0.81 pad 1.27)
  Top 0.406: v21.59,39.37 10.16,39.37 9.83,39.04 U$2.AN1 | E7.5 45.72,44.45 46.99,45.72 46.99,46.99 45.72,48.26 41.91,48.26 40.64,49.53 40.64,54.61 38.1,57.15 35.56,57.15 33.02,54.61 33.02,40.64 31.75,39.37 v29.21,39.37
  Bottom 0.406: v29.21,39.37 v21.59,39.37
GND  (via drill 0.81 pad 1.27)
  Top 0.813: E1.7 38.1,26.67 39.37,25.4 39.37,7.62 38.1,6.35 C1.2 34.29,6.35 31.75,8.89 v29.21,8.89 | E6.7 114.3,26.67 115.57,25.4 115.57,7.62 114.3,6.35 C6.2 110.49,6.35 107.95,8.89 v105.41,8.89 | E5.7 99.06,26.67 100.33,25.4 100.33,7.62 99.06,6.35 C5.2 | E4.7 83.82,26.67 85.09,25.4 85.09,7.62 83.82,6.35 C4.2 | E3.7 69.85,26.67 71.12,25.4 71.12,7.62 69.85,6.35 C3.2 | E2.7 53.34,26.67 54.61,25.4 54.61,7.62 53.34,6.35 C2.2 | E11.7 45.72,97.79 46.99,96.52 46.99,78.74 45.72,77.47 C11.2 | 45.72,54.61 46.99,53.34 46.99,50.8 45.72,49.53 E7.7 | 58.42,54.61 57.15,53.34 57.15,50.8 58.42,49.53 E8.7 | E9.7 73.66,49.53 72.39,50.8 72.39,53.34 73.66,54.61 C9.2 C13.2 73.66,77.47 72.39,78.74 72.39,97.79 E13.7 | E14.7 88.9,97.79 86.36,95.25 86.36,80.01 88.9,77.47 C14.2 | R4.1 76.2,118.11 77.47,119.38 77.47,121.92 76.2,123.19 v74.93,123.19 | E12.7 58.42,97.79 57.15,96.52 57.15,78.74 58.42,77.47 C12.2 | E15.7 45.72,120.65 46.99,121.92 46.99,124.46 45.72,125.73 C15.2 | E16.7 60.96,120.65 62.23,121.92 62.23,124.46 60.96,125.73 C16.2 | 45.72,54.61 48.26,54.61 50.8,57.15 55.88,57.15 58.42,54.61 | D1.C 114.3,85.09 116.84,82.55 116.84,73.66 115.57,72.39 111.76,72.39 110.49,71.12 | 110.49,71.12 110.49,49.53 v113.03,46.99 | 110.49,71.12 105.41,76.2 v105.41,77.47 | v105.41,49.53 C22.2 100.33,41.91 v97.79,41.91 | v21.59,125.73 19.05,125.73 15.24,121.92 11.43,121.92 11.1,121.59 U$2.BT1 | v29.21,54.61 29.21,55.88 31.75,58.42 41.91,58.42 44.45,55.88 C7.2 45.72,54.61 | v21.59,52.07 10.16,52.07 9.83,51.74 U$2.AT1 | C21.- 22.86,21.59 24.13,20.32 24.13,15.24 22.86,13.97 | 22.86,13.97 v21.59,13.97
  Top 0.813: v21.59,8.89 22.86,8.89 24.13,10.16 24.13,12.7 22.86,13.97 | E2.12 45.72,16.51 46.99,15.24 46.99,10.16 45.72,8.89 v44.45,8.89 | C17.2 99.06,125.73 100.33,124.46 100.33,121.92 99.06,120.65 E17.7 | C8.2 58.42,54.61
  Bottom 0.813: D1.C R6.1 R1.1 107.95,95.25 C23.2 v105.41,97.79 E18.1 E18.2 114.3,107.95 115.57,109.22 115.57,111.76 114.3,113.03 E18.4 E18.5 114.3,115.57 115.57,116.84 115.57,119.38 114.3,120.65 E18.7 111.76,120.65 106.68,125.73 C18.2 C17.2 95.25,125.73 92.71,123.19 v90.17,123.19 v82.55,123.19 v74.93,123.19 v67.31,123.19 64.77,123.19 62.23,125.73 C16.2 57.15,125.73 54.61,123.19 v52.07,123.19 49.53,123.19 46.99,125.73 C15.2 41.91,125.73 39.37,123.19 v36.83,123.19 34.29,123.19 31.75,125.73 v29.21,125.73 v21.59,125.73 | 92.71,50.8 92.71,53.34 91.44,54.61 C10.2 87.63,54.61 85.09,52.07 v82.55,52.07 80.01,52.07 77.47,54.61 C9.2 72.39,54.61 69.85,52.07 v67.31,52.07 64.77,52.07 62.23,54.61 C8.2 | 92.71,50.8 91.44,49.53 E10.7 | v97.79,41.91 95.25,41.91 | 95.25,41.91 92.71,44.45 92.71,50.8 | v29.21,54.61 26.67,54.61 24.13,52.07 v21.59,52.07 | U$2.AC2 11.1,10.49 11.43,10.16 16.51,10.16 17.78,8.89 v21.59,8.89 v29.21,8.89 | v105.41,8.89 102.87,8.89 100.33,6.35 C5.2 95.25,6.35 92.71,8.89 v90.17,8.89 87.63,8.89 85.09,6.35 C4.2 80.01,6.35 77.47,8.89 v74.93,8.89 72.39,8.89 69.85,6.35 C3.2 64.77,6.35 62.23,8.89 v59.69,8.89 57.15,8.89 54.61,6.35 C2.2 49.53,6.35 46.99,8.89 v44.45,8.89 41.91,8.89 39.37,6.35 C1.2 | U$2.BC2 16.84,80.34 C20.2 22.86,85.09 27.94,80.01 v29.21,80.01 v36.83,80.01 41.91,80.01 C11.2 46.99,80.01 v52.07,80.01 57.15,80.01 C12.2 62.23,80.01 v67.31,80.01 72.39,80.01 C13.2 77.47,80.01 v82.55,80.01 85.09,80.01 87.63,77.47 C14.2 92.71,74.93 102.87,74.93 v105.41,77.47 | 95.25,41.91 95.25,34.29 97.79,31.75 109.22,31.75 113.03,27.94 E6.7
  Bottom 0.813: v113.03,46.99 C22.2
IOCLR  (via drill 0.81 pad 1.27)
  Bottom 0.406: U$2.BE2 13.64,86.69 13.97,86.36 16.51,86.36 20.32,90.17 v21.59,90.17 24.13,90.17 26.67,87.63 v29.21,87.63 34.29,87.63 35.56,86.36 39.37,86.36 41.91,83.82 50.8,83.82 E12.13
IRQ
  Bottom 0.406: E14.9 83.82,95.25 85.09,96.52 85.09,97.79 83.82,99.06 57.15,99.06 54.61,96.52 50.8,96.52 46.99,100.33 17.78,100.33 16.82,99.36 U$2.BK2
LINE
  Bottom 0.406: U$2.AD2 13.67,13.66 13.97,13.97 16.51,13.97 20.32,10.16 30.48,10.16 35.56,5.08 40.64,5.08 43.18,7.62 45.72,7.62 48.26,5.08 55.88,5.08 58.42,7.62 60.96,7.62 63.5,5.08 71.12,5.08 73.66,7.62 76.2,7.62 78.74,5.08 86.36,5.08 88.9,7.62 91.44,7.62 93.98,5.08 101.6,5.08 104.14,7.62 114.3,7.62 116.84,10.16 116.84,19.05 114.3,21.59 E6.5
LOAD_BUFFER  (via drill 0.81 pad 1.27)
  Top 0.406: v21.59,44.45 20.32,44.45 15.24,48.26 10.16,48.26 9.86,48.56 U$2.AS1
  Bottom 0.406: v21.59,44.45 v29.21,44.45 E7.10
N$1
  Top 0.406: 67.31,105.41 C19.1 | R3.1 67.31,105.41 | 67.31,105.41 E13.8
N$2  (via drill 0.81 pad 1.27)
  Top 0.406: 78.74,105.41 78.74,99.06 76.2,96.52 73.66,96.52 73.66,93.98 E13.5 E13.4 | C19.2 78.74,105.41 | 78.74,105.41 v74.93,105.41 R4.2
N$3
  Top 0.406: E8.11 53.34,40.64 53.34,31.75 49.53,27.94 49.53,20.32 50.8,19.05 E2.4
N$4
  Top 0.406: E13.6 77.47,95.25 81.28,99.06 91.44,99.06 92.71,97.79 92.71,95.25 91.44,93.98 88.9,93.98 87.63,92.71 88.9,91.44 91.44,91.44 92.71,90.17 92.71,63.5 95.25,60.96 95.25,33.02 96.52,31.75 100.33,31.75 104.14,27.94 106.68,27.94 107.95,26.67 107.95,25.4 109.22,24.13 109.22,20.32 111.76,17.78 114.3,17.78 114.3,12.7 E6.1
N$5
  Top 0.406: E16.10 50.8,115.57 49.53,116.84 35.56,116.84 34.29,115.57 34.29,110.49 35.56,109.22 38.1,109.22 43.18,104.14 50.8,100.33 52.07,100.33 59.69,99.06 61.28,99.06 62.23,98.11 62.23,96.52 60.96,95.25 E12.6 | E6.11 102.87,19.05 101.6,20.32 101.6,26.67 99.06,29.21 96.52,29.21 92.71,33.02 92.71,44.45 91.44,45.72 88.9,45.72 87.63,46.99 87.63,76.2 85.09,78.74 85.09,88.9 83.82,90.17 E14.11
  Bottom 0.406: 110.49,16.51 E6.3 | 110.49,16.51 107.95,19.05 E6.11 | 110.49,16.51 109.22,15.24 102.87,15.24 101.6,16.51 E5.3 95.25,16.51 | 95.25,16.51 93.98,15.24 83.82,15.24 E4.3 80.01,16.51 | 80.01,16.51 78.74,15.24 68.58,15.24 E3.3 64.77,16.51 | 64.77,16.51 63.5,15.24 53.34,15.24 E2.3 49.53,16.51 46.99,19.05 E2.11 | E5.11 92.71,19.05 95.25,16.51 | E4.11 77.47,19.05 80.01,16.51 | E3.11 62.23,19.05 64.77,16.51 | E17.4 96.52,113.03 95.25,114.3 63.5,114.3 62.23,113.03 E16.4 57.15,113.03 54.61,115.57 E16.10 | E14.11 78.74,90.17 77.47,91.44 71.12,91.44 68.58,93.98 62.23,93.98 60.96,95.25 E12.6
N$6  (via drill 0.81 pad 1.27)
  Top 0.406: E14.12 81.28,87.63 78.74,85.09 78.74,81.28 77.47,80.01 | v74.93,80.01 77.47,80.01 | 77.47,80.01 78.74,78.74 78.74,49.53 77.47,48.26 71.12,48.26 69.85,49.53 E9.8 | E18.13 104.14,106.68 104.14,93.98 v105.41,92.71 106.68,92.71 107.95,91.44 107.95,88.9 106.68,87.63 v105.41,87.63
  Bottom 0.406: v105.41,87.63 102.87,87.63 101.6,86.36 96.52,86.36 95.25,85.09 95.25,80.01 93.98,78.74 88.9,78.74 86.36,81.28 76.2,81.28 v74.93,80.01
  Bottom 0.813: E18.12 E18.13
N$7
  Bottom 0.406: E9.12 64.77,36.83 64.77,33.02 59.69,27.94 55.88,27.94 E2.6
N$8  (via drill 0.81 pad 1.27)
  Top 0.813: C22.1 v105.41,52.07
  Bottom 0.406: Q3.C 111.76,49.53 106.68,54.61 C22.1 101.6,58.42 R9.1
N$9
  Top 0.406: E1.8 30.48,26.67 34.29,30.48 38.1,30.48 41.91,34.29 41.91,40.64 43.18,41.91 E7.4
N$12
  Bottom 0.406: E1.6 31.75,29.21 17.78,29.21 15.24,26.67 12.7,26.67 12.37,26.34 U$2.AJ2
N$13
  Bottom 0.406: U$2.AH2 12.37,23.19 12.7,22.86 15.24,22.86 20.32,27.94 30.48,27.94 E1.5
N$15
  Bottom 0.406: U$2.AF2 13.69,20.04 13.97,20.32 15.24,20.32 17.78,17.78 24.13,17.78 26.67,20.32 30.48,20.32 34.29,16.51 E1.3
N$16  (via drill 0.81 pad 1.27)
  other vias: 105.41,85.09
N$17
  Bottom 0.406: U$2.AE2 13.64,16.84 13.97,16.51 15.24,16.51 16.51,15.24 30.48,15.24 34.29,11.43 E1.1
N$19
  Top 0.406: E8.2 60.96,36.83 62.23,38.1 62.23,40.64 60.96,41.91 E8.4 58.42,41.91 57.15,43.18 57.15,46.99 58.42,48.26 62.23,48.26 63.5,49.53 63.5,54.61 64.77,55.88 68.58,55.88 69.85,54.61 69.85,52.07 68.58,50.8 66.04,50.8 66.04,48.26 69.85,48.26 72.39,45.72 76.2,45.72 81.28,50.8 83.82,50.8 85.09,49.53 85.09,44.45 | E10.12 83.82,39.37 85.09,40.64 85.09,44.45 | 85.09,44.45 E10.10
  Bottom 0.406: E7.11 38.1,41.91 43.18,36.83 E7.2 46.99,36.83 49.53,39.37 E8.12 54.61,39.37 57.15,36.83 E8.2 | E8.10 54.61,44.45 57.15,41.91 E8.4 | E10.1 88.9,34.29 83.82,39.37 E10.12 | E10.4 87.63,41.91 85.09,44.45 E10.10
N$20
  Top 0.406: E7.3 45.72,39.37 48.26,36.83 48.26,25.4 E2.10
N$22  (via drill 0.81 pad 1.27)
  Bottom 0.406: D2.C v105.41,82.55 100.33,82.55 D1.A
N$23  (via drill 0.81 pad 1.27)
  Bottom 0.406: D3.C v105.41,80.01 100.33,80.01 D2.A
N$24
  Top 0.406: R5.1 99.06,44.45 100.33,45.72 100.33,50.8 99.06,52.07 Q1.B
N$26
  Bottom 0.406: Q3.B 114.3,52.07 115.57,50.8 115.57,45.72 114.3,44.45 R7.1 111.76,44.45 109.22,43.18 109.22,39.37 106.68,36.83 Q2.C
N$27
  Top 0.406: R6.2 96.52,86.36 96.52,72.39 97.79,69.85 Q1.E
  Bottom 0.406: Q1.E 99.06,54.61 101.6,52.07 101.6,45.72 Q2.E
N$30
  Top 0.406: Q2.B 107.95,39.37 109.22,40.64 109.22,57.15 97.79,73.66 R8.2
  Bottom 0.406: D3.A R8.2
N$35  (via drill 0.81 pad 1.27)
  other vias: 113.03,97.79
N$40
  Top 0.406: R5.2 100.33,34.29 104.14,30.48 109.22,30.48 110.49,29.21 110.49,25.4 111.76,24.13 E6.6
N$54  (via drill 0.81 pad 1.27)
  other vias: 97.79,95.25
N$62
  Top 0.406: E13.13 64.77,85.09 63.5,86.36 63.5,99.06 62.23,100.33 59.69,100.33 52.07,101.6 50.8,101.6 45.72,106.68 43.18,106.68 E15.11
N$63  (via drill 0.81 pad 1.27)
  Top 0.406: v21.59,115.57 24.13,115.57 25.4,116.84 25.4,124.46 27.94,127 92.71,127 93.98,125.73 93.98,119.38 95.25,118.11 E17.6
  Bottom 0.406: U$2.BR2 13.64,115.24 13.97,115.57 v21.59,115.57
N$65
  Top 0.406: E8.3 58.42,38.1 58.42,31.75 64.77,27.94 64.77,20.32 66.04,19.05 E3.4
N$70  (via drill 0.81 pad 1.27)
  other vias: 97.79,39.37
N$71  (via drill 0.81 pad 1.27)
  other vias: 97.79,36.83
N$72  (via drill 0.81 pad 1.27)
  other vias: 113.03,41.91
N$73  (via drill 0.81 pad 1.27)
  other vias: 113.03,39.37
N$74  (via drill 0.81 pad 1.27)
  other vias: 113.03,36.83
N$129  (via drill 0.81 pad 1.27)
  Top 0.406: v21.59,123.19 22.86,123.19 27.94,128.27 101.6,128.27 102.87,127 102.87,121.92 104.14,120.65 E18.8 | v29.21,123.19 27.94,123.19 26.67,121.92 26.67,106.68 27.94,105.41 v29.21,105.41
  Bottom 0.406: v21.59,123.19 v29.21,123.19 | E15.1 41.91,105.41 40.64,104.14 33.02,104.14 31.75,105.41 v29.21,105.41
N$131
  Top 0.406: E15.3 45.72,110.49 48.26,107.95 48.26,105.41 50.8,102.87 52.07,102.87 59.69,101.6 62.23,101.6 64.77,99.06 64.77,88.9 66.04,87.63 E13.12
N$132
  Bottom 0.406: E11.3 E11.12
N$133  (via drill 0.81 pad 1.27)
  Top 0.406: 60.96,85.09 62.23,86.36 62.23,88.9 60.96,90.17 E12.4 E12.5 | 60.96,85.09 62.23,83.82 68.58,83.82 71.12,86.36 71.12,118.11 73.66,120.65 v74.93,120.65 | E18.9 104.14,118.11 102.87,116.84 93.98,116.84 E17.8 | 60.96,85.09 E12.2 E12.1
  Bottom 0.406: E17.8 v82.55,120.65 v74.93,120.65
N$138
  Top 0.406: E16.9 53.34,118.11 55.88,115.57 55.88,110.49 58.42,107.95 E16.2
N$142
  Bottom 0.406: E3.6 68.58,24.13 71.12,26.67 71.12,31.75 73.66,34.29 E9.1
N$147
  Top 0.406: E10.8 81.28,49.53 78.74,46.99 78.74,22.86 E4.4
N$152
  Bottom 0.406: E9.2 73.66,36.83 66.04,29.21 62.23,29.21 E3.8
N$153
  Bottom 0.406: E9.3 77.47,36.83 77.47,27.94 76.2,26.67 E4.8
N$154
  Bottom 0.406: E9.4 76.2,40.64 76.2,39.37 78.74,36.83 78.74,26.67 81.28,24.13 E4.6
N$155
  Bottom 0.406: E5.8 86.36,26.67 80.01,33.02 80.01,36.83 77.47,39.37 77.47,41.91 E9.5
N$156
  Bottom 0.406: E5.6 96.52,24.13 91.44,29.21 85.09,29.21 81.28,33.02 81.28,36.83 78.74,39.37 78.74,43.18 E9.6
N$161  (via drill 0.81 pad 1.27)
  Bottom 0.406: E17.2 99.06,107.95 100.33,109.22 100.33,118.11 99.06,119.38 64.77,119.38 62.23,121.92 46.99,121.92 45.72,123.19 v44.45,123.19 41.91,123.19 39.37,120.65 E15.8
N$163
  Top 0.406: E13.2 E13.1
  Bottom 0.406: E11.6 45.72,95.25 49.53,91.44 54.61,91.44 57.15,88.9 69.85,88.9 73.66,85.09 E13.2
N$166  (via drill 0.81 pad 1.27)
  Top 0.406: v82.55,115.57 81.28,115.57 80.01,114.3 80.01,109.22 81.28,107.95 v82.55,107.95
  Bottom 0.406: E17.5 96.52,115.57 95.25,116.84 85.09,116.84 83.82,115.57 v82.55,115.57 | v82.55,107.95 81.28,107.95 80.01,106.68 64.77,106.68 62.23,109.22 54.61,109.22 53.34,110.49 E16.12
N$167
  Top 0.406: E14.10 81.28,92.71 76.2,87.63 E13.3
N$171
  Top 0.406: E10.3 88.9,39.37 87.63,38.1 87.63,33.02 92.71,27.94 92.71,25.4 95.25,22.86 95.25,21.59 E5.4
N$178
  Bottom 0.406: E14.2 88.9,85.09 85.09,88.9 71.12,88.9 69.85,90.17 E13.11
N$197  (via drill 0.81 pad 1.27)
  other vias: 97.79,8.89
N$199  (via drill 0.81 pad 1.27)
  other vias: 82.55,8.89
N$203  (via drill 0.81 pad 1.27)
  other vias: 52.07,8.89
N$210  (via drill 0.81 pad 1.27)
  other vias: 59.69,52.07
N$214  (via drill 0.81 pad 1.27)
  other vias: 90.17,52.07
N$215  (via drill 0.81 pad 1.27)
  other vias: 97.79,46.99
N$217  (via drill 0.81 pad 1.27)
  other vias: 105.41,44.45
N$223  (via drill 0.81 pad 1.27)
  other vias: 120.65,34.29
N$224  (via drill 0.81 pad 1.27)
  other vias: 120.65,36.83
N$225  (via drill 0.81 pad 1.27)
  other vias: 120.65,39.37
N$226  (via drill 0.81 pad 1.27)
  other vias: 120.65,41.91
N$227  (via drill 0.81 pad 1.27)
  other vias: 120.65,44.45
N$228  (via drill 0.81 pad 1.27)
  other vias: 120.65,46.99
N$229  (via drill 0.81 pad 1.27)
  other vias: 120.65,49.53
N$230  (via drill 0.81 pad 1.27)
  other vias: 120.65,52.07
N$231  (via drill 0.81 pad 1.27)
  other vias: 120.65,8.89
N$232  (via drill 0.81 pad 1.27)
  other vias: 120.65,11.43
N$233  (via drill 0.81 pad 1.27)
  other vias: 120.65,13.97
N$234  (via drill 0.81 pad 1.27)
  other vias: 120.65,16.51
N$235  (via drill 0.81 pad 1.27)
  other vias: 120.65,19.05
N$236  (via drill 0.81 pad 1.27)
  other vias: 120.65,21.59
N$237  (via drill 0.81 pad 1.27)
  other vias: 120.65,24.13
N$238  (via drill 0.81 pad 1.27)
  other vias: 120.65,26.67
N$266  (via drill 0.81 pad 1.27)
  other vias: 120.65,120.65
N$267  (via drill 0.81 pad 1.27)
  other vias: 120.65,123.19
N$268  (via drill 0.81 pad 1.27)
  other vias: 120.65,118.11
N$269  (via drill 0.81 pad 1.27)
  other vias: 120.65,115.57
N$270  (via drill 0.81 pad 1.27)
  other vias: 120.65,113.03
N$271  (via drill 0.81 pad 1.27)
  other vias: 120.65,110.49
N$272  (via drill 0.81 pad 1.27)
  other vias: 120.65,107.95
N$273  (via drill 0.81 pad 1.27)
  other vias: 120.65,105.41
N$274  (via drill 0.81 pad 1.27)
  other vias: 120.65,95.25
N$275  (via drill 0.81 pad 1.27)
  other vias: 120.65,92.71
N$276  (via drill 0.81 pad 1.27)
  other vias: 120.65,90.17
N$277  (via drill 0.81 pad 1.27)
  other vias: 120.65,87.63
N$278  (via drill 0.81 pad 1.27)
  other vias: 120.65,85.09
N$279  (via drill 0.81 pad 1.27)
  other vias: 120.65,82.55
N$280  (via drill 0.81 pad 1.27)
  other vias: 120.65,80.01
N$281  (via drill 0.81 pad 1.27)
  other vias: 67.31,120.65
N$284  (via drill 0.81 pad 1.27)
  other vias: 59.69,123.19
N$289  (via drill 0.81 pad 1.27)
  other vias: 67.31,115.57
N$290  (via drill 0.81 pad 1.27)
  other vias: 67.31,113.03
N$291  (via drill 0.81 pad 1.27)
  other vias: 67.31,110.49
N$292  (via drill 0.81 pad 1.27)
  other vias: 74.93,110.49
N$293  (via drill 0.81 pad 1.27)
  other vias: 74.93,113.03
N$294  (via drill 0.81 pad 1.27)
  other vias: 74.93,115.57
N$296  (via drill 0.81 pad 1.27)
  other vias: 82.55,110.49
N$297  (via drill 0.81 pad 1.27)
  other vias: 82.55,113.03
N$299  (via drill 0.81 pad 1.27)
  other vias: 82.55,118.11
N$303  (via drill 0.81 pad 1.27)
  other vias: 113.03,123.19
N$304  (via drill 0.81 pad 1.27)
  other vias: 105.41,123.19
N$305  (via drill 0.81 pad 1.27)
  other vias: 97.79,123.19
N$307  (via drill 0.81 pad 1.27)
  other vias: 90.17,80.01
N$311  (via drill 0.81 pad 1.27)
  other vias: 59.69,80.01
N$314  (via drill 0.81 pad 1.27)
  other vias: 44.45,80.01
N$317  (via drill 0.81 pad 1.27)
  other vias: 29.21,82.55
N$320  (via drill 0.81 pad 1.27)
  other vias: 29.21,90.17
N$329  (via drill 0.81 pad 1.27)
  other vias: 21.59,82.55
N$330  (via drill 0.81 pad 1.27)
  other vias: 21.59,80.01
N$345  (via drill 0.81 pad 1.27)
  other vias: 29.21,113.03
N$349  (via drill 0.81 pad 1.27)
  other vias: 21.59,105.41
N$358
  Bottom 0.406: E17.12 88.9,110.49 87.63,111.76 57.15,111.76 54.61,114.3 43.18,114.3 41.91,115.57 41.91,116.84 43.18,118.11 E15.6
N$362
  Bottom 0.406: E17.9 85.09,118.11 83.82,116.84 48.26,116.84 46.99,115.57 E15.5
N$378
  Top 0.406: E3.10 55.88,25.4 55.88,46.99 53.34,49.53 E8.8
N$381
  Top 0.406: E4.10 72.39,24.13 72.39,26.67 63.5,35.56 63.5,45.72 62.23,46.99 E8.6
N$387
  Top 0.406: E10.11 81.28,41.91 80.01,40.64 80.01,33.02 87.63,25.4 87.63,24.13 E5.10
N$393
  Top 0.406: E6.10 104.14,21.59 102.87,22.86 102.87,27.94 100.33,30.48 96.52,30.48 93.98,33.02 93.98,45.72 92.71,46.99 E10.6
N$460
  Bottom 0.813: E18.10 E18.11
SELECTED
  Top 0.406: 35.56,85.09 34.29,83.82 34.29,72.39 26.67,57.15 26.67,39.37 27.94,38.1 31.75,38.1 33.02,36.83 33.02,34.29 34.29,33.02 39.37,33.02 40.64,34.29 40.64,45.72 41.91,46.99 E7.6 | 35.56,85.09 E11.13 | 35.56,85.09 34.29,86.36 34.29,88.9 35.56,90.17 E11.11
  Bottom 0.406: E7.6 E7.9
SERIAL_OUT
  Bottom 0.406: U$2.AV2 13.58,58.03 13.97,58.42 R9.2
SIZE
  Top 0.406: U$2.AK1 11.13,29.52 11.43,29.21 20.32,29.21 22.86,33.02 22.86,62.23 24.13,64.77 24.13,96.52 29.21,101.6 36.83,101.6 39.37,104.14 39.37,105.41 E15.13
SKIP
  Bottom 0.406: U$2.BJ2 13.64,96.19 13.97,96.52 16.51,96.52 19.05,99.06 33.02,99.06 34.29,97.79 E11.8
SKP_STROBE  (via drill 0.81 pad 1.27)
  Bottom 0.406: U$2.BH2 13.64,93.04 13.97,92.71 17.78,92.71 20.32,95.25 v21.59,95.25 v29.21,95.25 E11.9
STOP  (via drill 0.81 pad 1.27)
  Bottom 0.406: U$2.BN2 13.64,108.89 13.97,109.22 17.78,109.22 19.05,107.95 v21.59,107.95 v29.21,107.95 31.75,107.95 34.29,110.49 E15.12
VCC  (via drill 0.81 pad 1.27)
  Top 0.813: E1.14 27.94,11.43 26.67,10.16 26.67,7.62 27.94,6.35 C1.1 | E6.14 104.14,11.43 102.87,10.16 102.87,7.62 104.14,6.35 C6.1 | E2.14 43.18,11.43 41.91,10.16 41.91,7.62 43.18,6.35 C2.1 | E14.14 81.28,82.55 80.01,81.28 80.01,78.74 81.28,77.47 C14.1 | E7.14 35.56,34.29 34.29,35.56 34.29,53.34 35.56,54.61 C7.1 | E8.14 50.8,34.29 49.53,35.56 49.53,53.34 50.8,54.61 C8.1 | E13.14 68.58,82.55 69.85,81.28 69.85,78.74 68.58,77.47 C13.1 | v67.31,125.73 68.58,125.73 69.85,124.46 69.85,119.38 68.58,118.11 R3.2 66.04,118.11 63.5,115.57 63.5,105.41 61.91,103.82 60.01,103.82 E16.14 | E12.14 53.34,82.55 54.61,81.28 54.61,78.74 53.34,77.47 C12.1 | E15.14 34.29,105.41 33.02,106.68 33.02,124.46 34.29,125.73 C15.1 | E9.14 64.77,36.83 64.77,53.34 66.04,54.61 C9.1 | E10.14 83.82,34.29 86.36,36.83 86.36,52.07 83.82,54.61 C10.1 | E18.14 109.22,101.6 109.22,97.79 111.76,95.25 C23.1 | E5.14 91.44,11.43 92.71,10.16 92.71,7.62 91.44,6.35 C5.1 | E4.14 76.2,11.43 77.47,10.16 77.47,7.62 76.2,6.35 C4.1 | E3.14 60.96,11.43 62.23,10.16 62.23,7.62 60.96,6.35 C3.1 | E11.14 38.1,82.55 39.37,81.28 39.37,78.74 38.1,77.47 C11.1 | C17.1 88.9,125.73 87.63,124.46 87.63,106.68 88.9,105.41 E17.14
  Bottom 0.813: R8.1 114.3,77.47 115.57,78.74 115.57,91.44 114.3,92.71 R2.2 C23.1 116.84,99.06 116.84,121.92 C18.1 110.49,128.27 92.71,128.27 C17.1 v82.55,125.73 v74.93,125.73 v67.31,125.73 64.77,128.27 54.61,128.27 C16.1 49.53,128.27 39.37,128.27 C15.1 | R8.1 Q3.E 114.3,54.61 116.84,52.07 116.84,36.83 114.3,34.29 | 114.3,34.29 R7.2 v105.41,34.29 104.14,34.29 100.33,38.1 100.33,48.26 99.06,49.53 Q1.C 96.52,49.53 95.25,50.8 95.25,53.34 91.44,57.15 86.36,57.15 83.82,54.61 C10.1 80.01,57.15 69.85,57.15 C9.1 64.77,56.83 54.61,56.83 C8.1 49.53,57.15 39.37,57.15 C7.1 | U$2.AA2 16.91,4.21 19.05,6.35 C21.+ C1.1 31.75,3.81 41.91,3.81 C2.1 46.99,3.81 57.15,3.81 C3.1 62.23,3.81 72.39,3.81 C4.1 77.47,3.81 87.63,3.81 C5.1 92.71,3.81 102.87,3.81 C6.1 107.95,3.81 114.3,3.81 118.11,7.62 118.11,30.48 114.3,34.29 | U$2.BA2 13.57,74.06 13.97,73.66 17.78,73.66 C20.1 v29.21,77.47 C11.1 36.83,76.2 38.1,74.93 50.8,74.93 52.07,76.2 | 52.07,76.2 C12.1 | 67.31,76.2 C13.1 | 67.31,76.2 66.04,74.93 53.34,74.93 52.07,76.2 | 82.55,76.2 C14.1 | 82.55,76.2 81.28,74.93 68.58,74.93 67.31,76.2 | 82.55,76.2 85.09,73.66 109.22,73.66 R8.1

### Text on the board
Top: FLIP CHIP | DEC
Bottom: TELETYPE TRANSMITTER M707A